# EasyEDA schematic 1-Schematic_spring.json
TITLE: Sheet_1; REV: 1.0; Date: 2019-08-29; Sheet: 1/1; Company: Your Company
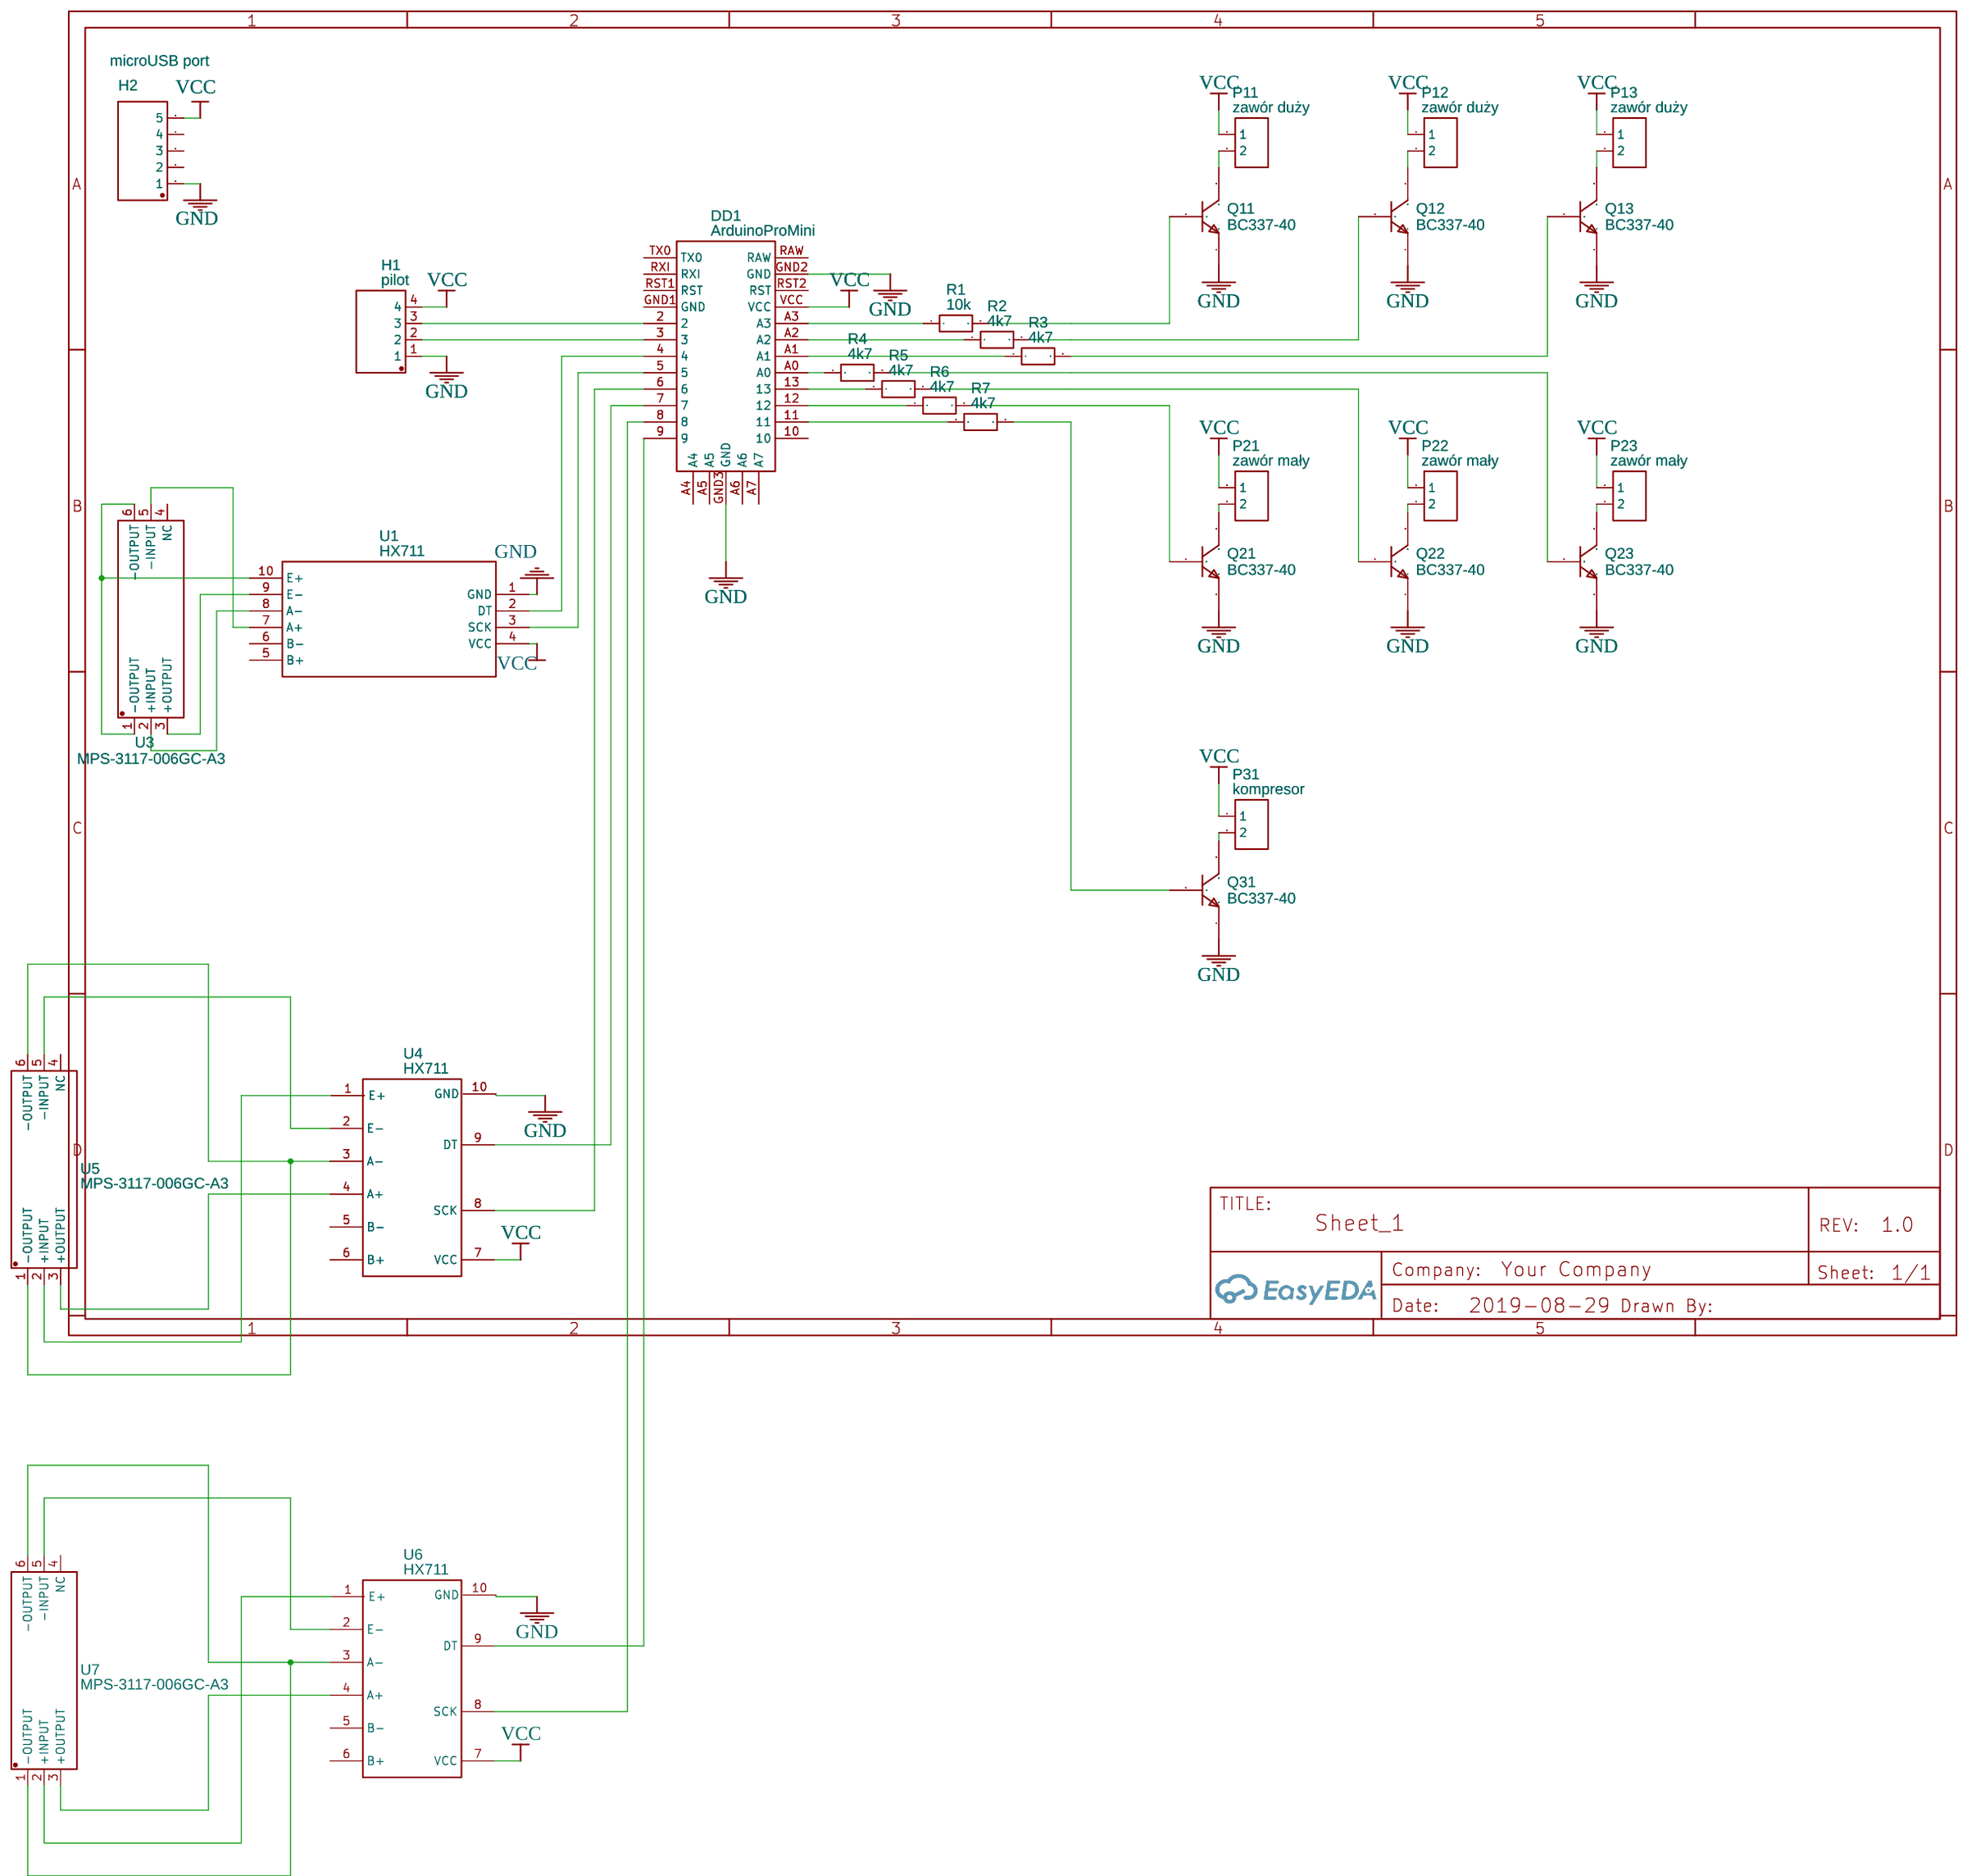
[diagram p0: schematic sheet]

## Parts
DD1  ArduinoProMini  [ADRDUINOPROMINI]
H1  pilot  [DIP-1X4P-2.54MM-M]
H2  microUSB port  [DIP-1X5P-2.54MM-M]
P11  zawór duży  [HDR-1X2/2.54]
P12  zawór duży  [HDR-1X2/2.54]
P13  zawór duży  [HDR-1X2/2.54]
P21  zawór mały  [HDR-1X2/2.54]
P22  zawór mały  [HDR-1X2/2.54]
P23  zawór mały  [HDR-1X2/2.54]
P31  kompresor  [HDR-1X2/2.54]
Q11  BC337-40  [TO-92_L4.8-W3.7-P2.54-L]
Q12  BC337-40  [TO-92_L4.8-W3.7-P2.54-L]
Q13  BC337-40  [TO-92_L4.8-W3.7-P2.54-L]
Q21  BC337-40  [TO-92_L4.8-W3.7-P2.54-L]
Q22  BC337-40  [TO-92_L4.8-W3.7-P2.54-L]
Q23  BC337-40  [TO-92_L4.8-W3.7-P2.54-L]
Q31  BC337-40  [TO-92_L4.8-W3.7-P2.54-L]
R1  10k  [AXIAL-0.3]
R2  4k7  [AXIAL-0.3]
R3  4k7  [AXIAL-0.3]
R4  4k7  [AXIAL-0.3]
R5  4k7  [AXIAL-0.3]
R6  4k7  [AXIAL-0.3]
R7  4k7  [AXIAL-0.3]
U1  HX711  [HX711]
U3  MPS-3117-006GC-A3  [MPS20N0040D-D]
U4  HX711  [HX]
U5  MPS-3117-006GC-A3  [MPS20N0040D-D]
U6  HX711  [HX]
U7  MPS-3117-006GC-A3  [MPS20N0040D-D]

## Library data of the parts
DD1 = -: Contributor: arkos
H1 = -: Supplier: LCSC; Manufacturer: Ckmtw; Manufacturer Part: 210S-1*4P L=11.6MMGold-plated black; Contributor: LCSC; Supplier Part: C124378
H2 = -: Supplier: LCSC; Manufacturer: Ckmtw; Manufacturer Part: 210S-1*5P L=11.6MMGold-plated black; Contributor: LCSC; Supplier Part: C124379
P11-P13 P21-P23 P31 = -: Supplier: LCSC; Manufacturer: BOOMELE; Manufacturer Part: 2.54-1*2PFemale; image: //image.lceda.cn/szlcsc/C49661.jpg; Supplier Part: C49661
Q11-Q13 Q21-Q23 Q31 = -: NPN General-purpose Transistor
R1-R7 = Res_AXIAL-0.3(1/8W)_EU
U1 = -: Contributor: oskarissimus
U3 U5 U7 = -: Supplier: LCSC; Supplier Part: C242002; Manufacturer: Metrodyne Microsystem; Contributor: LCSC
U4 U6 = -: Supplier: AVIA Semiconductor; Contributor: evillee1123

## Nets
GND: DD1.GND2(GND) DD1.GND3(GND) H1.1 H2.1 Q11.1(E) Q12.1(E) Q13.1(E) Q21.1(E) Q22.1(E) Q23.1(E) Q31.1(E) U1.1(GND) U4.10(GND) U6.10(GND)
VCC: DD1.VCC H1.4 H2.5 P11.1 P12.1 P13.1 P21.1 P22.1 P23.1 P31.1 U1.4(VCC) U4.7(VCC) U6.7(VCC)
Net-(DD1-2): DD1.2 H1.3
Net-(DD1-3): DD1.3 H1.2
Net-(DD1-4): DD1.4 U1.2(DT)
Net-(DD1-5): DD1.5 U1.3(SCK)
Net-(DD1-6): DD1.6 U4.8(SCK)
Net-(DD1-7): DD1.7 U4.9(DT)
Net-(DD1-8): DD1.8 U6.8(SCK)
Net-(DD1-9): DD1.9 U6.9(DT)
Net-(DD1-11): DD1.11 R7.1
Net-(DD1-12): DD1.12 R6.1
Net-(DD1-13): DD1.13 R5.1
Net-(DD1-A0): DD1.A0 R4.1
Net-(DD1-A1): DD1.A1 R3.1
Net-(DD1-A2): DD1.A2 R2.1
Net-(DD1-A3): DD1.A3 R1.1
Net-(P11-2): P11.2 Q11.3(C)
Net-(P12-2): P12.2 Q12.3(C)
Net-(P13-2): P13.2 Q13.3(C)
Net-(P21-2): P21.2 Q21.3(C)
Net-(P22-2): P22.2 Q22.3(C)
Net-(P23-2): P23.2 Q23.3(C)
Net-(P31-2): P31.2 Q31.3(C)
Net-(Q11-2): Q11.2(B) R1.2
Net-(Q12-2): Q12.2(B) R2.2
Net-(Q13-2): Q13.2(B) R3.2
Net-(Q21-2): Q21.2(B) R6.2
Net-(Q22-2): Q22.2(B) R5.2
Net-(Q23-2): Q23.2(B) R4.2
Net-(Q31-2): Q31.2(B) R7.2
Net-(U1-7): U1.7(A+) U3.5(-INPUT)
Net-(U1-8): U1.8(A-) U3.2(+INPUT)
Net-(U1-9): U1.9(E-) U3.3(+OUTPUT)
Net-(U1-10): U1.10(E+) U3.1(-OUTPUT) U3.6(-OUTPUT)
Net-(U4-1): U4.1(E+) U5.2(+INPUT)
Net-(U4-2): U4.2(E-) U5.5(-INPUT)
Net-(U4-3): U4.3(A-) U5.1(-OUTPUT) U5.6(-OUTPUT)
Net-(U4-4): U4.4(A+) U5.3(+OUTPUT)
Net-(U6-1): U6.1(E+) U7.2(+INPUT)
Net-(U6-2): U6.2(E-) U7.5(-INPUT)
Net-(U6-3): U6.3(A-) U7.1(-OUTPUT) U7.6(-OUTPUT)
Net-(U6-4): U6.4(A+) U7.3(+OUTPUT)

Not connected (* = marked no-connect by the designer): DD1 10 A4 A5 A6 A7 GND1(GND) RAW RST1(RST) RST2(RST) RXI TX0; H2 2 3 4; U1 5(B+) 6(B-); U3 4(NC); U4 5(B-) 6(B+); U5 4(NC); U6 5(B-) 6(B+); U7 4(NC)
